# Altium schematic sheet AMU_POC_final.SchDoc
size A; Engineer: Anthony Kellam; : QUTMS Motor Control version 0.1; PageSetup: Record=PageOptions|CenterHorizontal=True|CenterVertical=True|PrintScale=1.00|XCorrection=1.00|YCorrection=1.00|PrintKind=0|BorderSize=5000000|LeftOffset=0|BottomOffset=0|Orientation=1|PaperLength=1000|PaperWidth=1000|Scale=100|PaperSource=7|PrintQuality=-4|MediaType=1|DitherType=10|PaperKind=A4 (210 x 297 mm)|PrintScaleMode=0; DocumentName: QUTMS Motor Control rev A
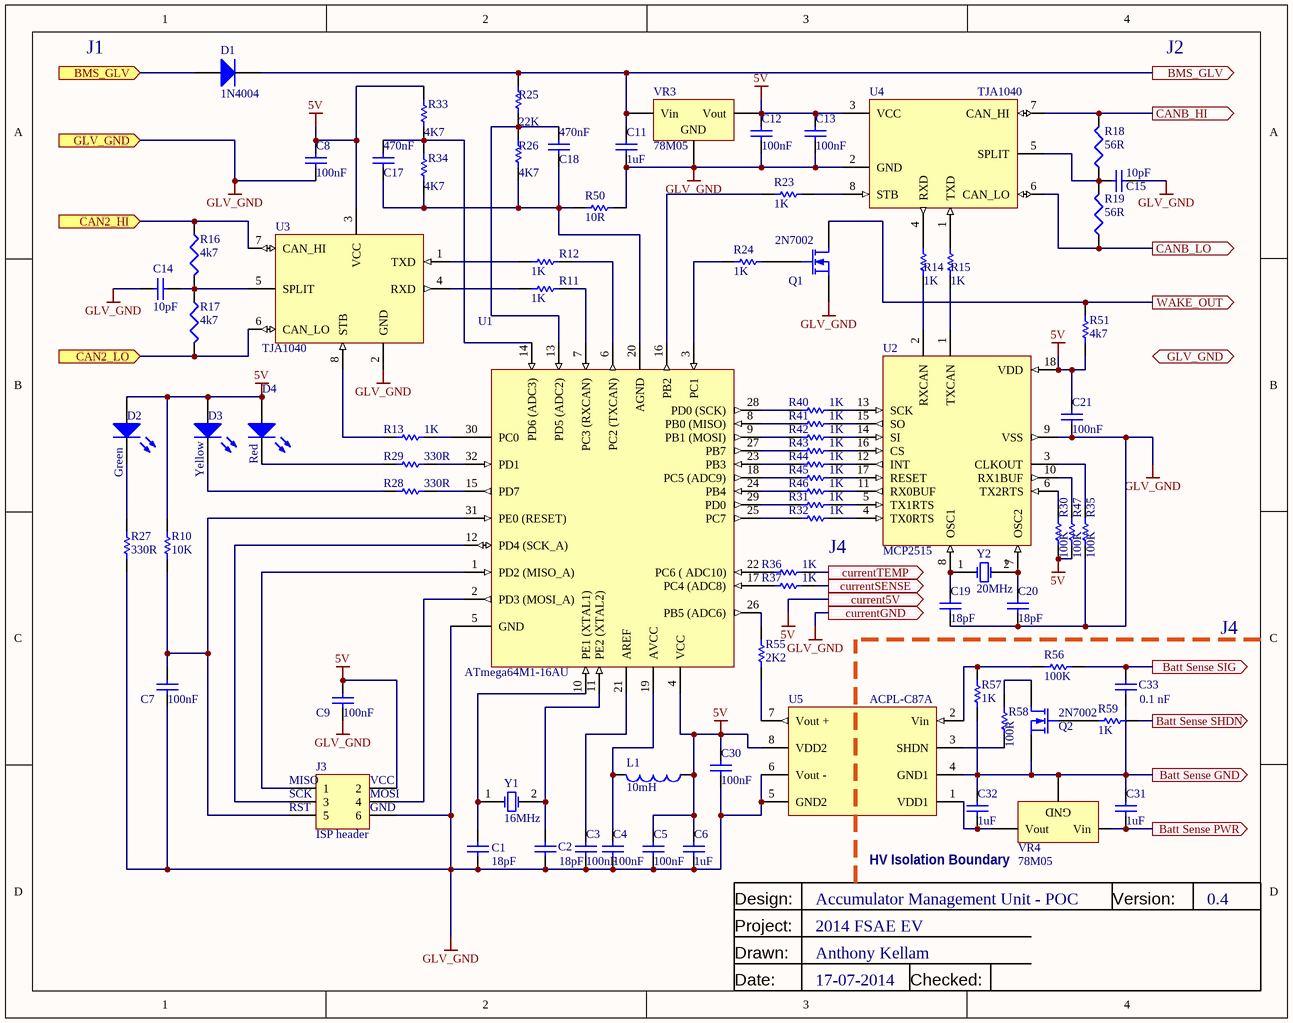
[diagram p0: AMU_POC_final.SchDoc]

## Parts
C1  value 18pF  [0402]  (hidden comment: Cap Semi)
C2  value 18pF  [0402]  (hidden comment: Cap Semi)
C3  value 100nF  [0402]  (hidden comment: Cap Semi)
C4  value 100nF  [0402]  (hidden comment: Cap Semi)
C5  value 100nF  [0402]  (hidden comment: Cap Semi)
C6  value 1uF  [0402]  (hidden comment: Cap Semi)
C7  value 100nF  [0402]  (hidden comment: Cap Semi)
C8  value 100nF  [0402]  (hidden comment: Cap Semi)
C9  value 100nF  [0402]  (hidden comment: Cap Semi)
C11  value 1uF  [0402]  (hidden comment: Cap Semi)
C12  value 100nF  [0402]  (hidden comment: Cap Semi)
C13  value 100nF  [0402]  (hidden comment: Cap Semi)
C14  value 10pF  [0402]  (hidden comment: Cap Semi)
C15  value 10pF  [0402]  (hidden comment: Cap Semi)
C17  value 470nF  [0402]  (hidden comment: Cap Semi)
C18  value 470nF  [0402]  (hidden comment: Cap Semi)
C19  value 18pF  [0402]  (hidden comment: Cap Semi)
C20  value 18pF  [0402]  (hidden comment: Cap Semi)
C21  value 100nF  [0402]  (hidden comment: Cap Semi)
C30  value 100nF  [0402]  (hidden comment: Cap Semi)
C31  value 1uF  [0402]  (hidden comment: Cap Semi)
C32  value 1uF  [0402]  (hidden comment: Cap Semi)
C33  value 0.1 nF  [0402]  (hidden comment: Cap Semi)
D1  1N4004  [SMC]
D2  Green  [3.2X1.6X1.1]
D3  Yellow  [3.2X1.6X1.1]
D4  Red  [3.2X1.6X1.1]
J3  ISP header  [HDR2X3]
L1  value 10mH  [0402-A]  (hidden comment: Inductor)
Q1  2N7002  [E3]
Q2  2N7002  [E3]
R10  value 10K  [AXIAL-0.3]  (hidden comment: Res1)
R11  value 1K  [AXIAL-0.3]  (hidden comment: Res1)
R12  value 1K  [AXIAL-0.3]  (hidden comment: Res1)
R13  value 1K  [AXIAL-0.3]  (hidden comment: Res1)
R14  value 1K  [AXIAL-0.3]  (hidden comment: Res1)
R15  value 1K  [AXIAL-0.3]  (hidden comment: Res1)
R16  value 4k7  [J1-0603]  (hidden comment: Res3)
R17  value 4k7  [J1-0603]  (hidden comment: Res3)
R18  value 56R  [J1-0603]  (hidden comment: Res3)
R19  value 56R  [J1-0603]  (hidden comment: Res3)
R23  value 1K  [AXIAL-0.3]  (hidden comment: Res1)
R24  value 1K  [AXIAL-0.3]  (hidden comment: Res1)
R25  value 22K  [AXIAL-0.3]  (hidden comment: Res1)
R26  value 4K7  [AXIAL-0.3]  (hidden comment: Res1)
R27  value 330R  [AXIAL-0.3]  (hidden comment: Res1)
R28  value 330R  [AXIAL-0.3]  (hidden comment: Res1)
R29  value 330R  [AXIAL-0.3]  (hidden comment: Res1)
R30  value 100K  [AXIAL-0.3]  (hidden comment: Res1)
R31  value 1K  [AXIAL-0.3]  (hidden comment: Res1)
R32  value 1K  [AXIAL-0.3]  (hidden comment: Res1)
R33  value 4K7  [AXIAL-0.3]  (hidden comment: Res1)
R34  value 4K7  [AXIAL-0.3]  (hidden comment: Res1)
R35  value 100K  [AXIAL-0.3]  (hidden comment: Res1)
R36  value 1K  [AXIAL-0.3]  (hidden comment: Res1)
R37  value 1K  [AXIAL-0.3]  (hidden comment: Res1)
R40  value 1K  [AXIAL-0.3]  (hidden comment: Res1)
R41  value 1K  [AXIAL-0.3]  (hidden comment: Res1)
R42  value 1K  [AXIAL-0.3]  (hidden comment: Res1)
R43  value 1K  [AXIAL-0.3]  (hidden comment: Res1)
R44  value 1K  [AXIAL-0.3]  (hidden comment: Res1)
R45  value 1K  [AXIAL-0.3]  (hidden comment: Res1)
R46  value 1K  [AXIAL-0.3]  (hidden comment: Res1)
R47  value 100K  [AXIAL-0.3]  (hidden comment: Res1)
R50  value 10R  [AXIAL-0.3]  (hidden comment: Res1)
R51  value 4k7  [AXIAL-0.3]  (hidden comment: Res1)
R55  value 2K2  [AXIAL-0.3]  (hidden comment: Res1)
R56  value 100K  [AXIAL-0.3]  (hidden comment: Res1)
R57  value 1K  [AXIAL-0.3]  (hidden comment: Res1)
R58  value 100R  [AXIAL-0.3]  (hidden comment: Res1)
R59  value 1K  [AXIAL-0.3]  (hidden comment: Res1)
U1  ATmega64M1-16AU  [32A_L]
U2  MCP2515  [Q-18]
U3  TJA1040  [8S2_L]
U4  TJA1040  [8S2_L]
U5  ACPL-C87A  [8S2_L]
VR3  78M05  [D2PAK]
VR4  78M05  [D2PAK]
Y1  16MHz  [R38]
Y2  20MHz  [R38]

## Ports
Batt Sense GND (out), Batt Sense PWR (out), Batt Sense SHDN (out), Batt Sense SIG (out), BMS_GLV, BMS_GLV (in), CAN2_HI (in), CAN2_LO (in), CANB_HI (out), CANB_LO (out), current5V (out), currentGND (out), currentSENSE (out), currentTEMP (out), GLV_GND (in), GLV_GND (out), WAKE_OUT (out)

## Nets
5V: C5.1 C6.1 C8.2 C9.2 C12.2 C13.2 C21.2 C30.1 D2.1(A) D3.1(A) D4.1(A) J3.2 L1.1 R10.2 R30.2 R33.1 R47.2 R51.1 U1.4(VCC) U2.18(VDD) U3.3(VCC) U4.3(VCC) U5.8(VDD2) VR3.3(Vout) ; port current5V
GLV_GND: C1.1 C2.1 C3.2 C4.2 C5.2 C6.2 C7.1 C8.1 C9.1 C11.1 C12.1 C13.1 C14.1 C15.1 C19.1 C20.1 C21.1 C30.2 J3.6 Q1.3(S) R27.1 R35.2 R50.2 U1.5(GND) U2.9(VSS) U3.2(GND) U4.2(GND) U5.5(GND2) U5.6(Vout_-) VR3.2(GND) ; port GLV_GND, port currentGND
Batt Sense GND: C31.2 C32.2 C33.1 Q2.3(S) R57.1 U5.4(GND1) VR4.2(GND) ; port Batt Sense GND
Batt Sense PWR: C31.1 VR4.1(Vin) ; port Batt Sense PWR
Batt Sense SHDN: R59.1 ; port Batt Sense SHDN
Batt Sense SIG: C33.2 R56.1 ; port Batt Sense SIG
BMS_GLV: C11.2 D1.1(A) D1.2(K) R25.1 VR3.1(Vin) ; port BMS_GLV
CAN2_HI: R16.1 U3.7(CAN_HI) ; port CAN2_HI
CAN2_LO: R17.2 U3.6(CAN_LO) ; port CAN2_LO
CANB_HI: R18.2 U4.7(CAN_HI) ; port CANB_HI
CANB_LO: R19.1 U4.6(CAN_LO) ; port CANB_LO
currentSENSE: R37.2 ; port currentSENSE
currentTEMP: R36.2 ; port currentTEMP
WAKE_OUT: Q1.1(D) R51.2 ; port WAKE_OUT
NetC1_2: C1.2 U1.10(PE1_(XTAL1)) Y1.1(OSC1)
NetC2_2: C2.2 U1.11(PE2_(XTAL2)) Y1.2(OSC2)
NetC3_1: C3.1 U1.21(AREF)
NetC4_1: C4.1 L1.2 U1.19(AVCC)
NetC7_2: C7.2 J3.5 R10.1 U1.31(PE0_(RESET))
NetC14_2: C14.2 R16.2 R17.1 U3.5(SPLIT)
NetC15_2: C15.2 R18.1 R19.2 U4.5(SPLIT)
NetC17_1: C17.1 C18.1 R26.2 R34.2 R50.1 U1.20(AGND)
NetC17_2: C17.2 R33.2 R34.1 U1.14(PD6_(ADC3))
NetC18_2: C18.2 R25.2 R26.1 U1.13(PD5_(ADC2))
NetC19_2: C19.2 U2.8(OSC1) Y2.1(OSC1)
NetC20_2: C20.2 U2.7(OSC2) Y2.2(OSC2)
NetC32_1: C32.1 U5.1(VDD1) VR4.3(Vout)
NetD2_2: D2.2(K) R27.2
NetD3_2: D3.2(K) R28.1
NetD4_2: D4.2(K) R29.1
NetJ3_1: J3.1 U1.1(PD2_(MISO_A))
NetJ3_3: J3.3 U1.12(PD4_(SCK_A))
NetJ3_4: J3.4 U1.2(PD3_(MOSI_A))
NetQ1_2: Q1.2(G) R24.2
NetQ2_1: Q2.1(D) R58.2
NetQ2_2: Q2.2(G) R59.2
NetR11_1: R11.1 U3.4(RXD)
NetR11_2: R11.2 U1.7(PC3_(RXCAN))
NetR12_1: R12.1 U1.6(PC2_(TXCAN))
NetR12_2: R12.2 U3.1(TXD)
NetR13_1: R13.1 U3.8(STB)
NetR13_2: R13.2 U1.30(PC0)
NetR14_1: R14.1 U4.4(RXD)
NetR14_2: R14.2 U2.2(RXCAN)
NetR15_1: R15.1 U4.1(TXD)
NetR15_2: R15.2 U2.1(TXCAN)
NetR23_1: R23.1 U1.16(PB2)
NetR23_2: R23.2 U4.8(STB)
NetR24_1: R24.1 U1.3(PC1)
NetR28_2: R28.2 U1.15(PD7)
NetR29_2: R29.2 U1.32(PD1)
NetR30_1: R30.1 U2.6(TX2RTS)
NetR31_1: R31.1 U1.29(PD0)
NetR31_2: R31.2 U2.5(TX1RTS)
NetR32_1: R32.1 U1.25(PC7)
NetR32_2: R32.2 U2.4(TX0RTS)
NetR35_1: R35.1 U2.3(CLKOUT)
NetR36_1: R36.1 U1.22(PC6_(_ADC10))
NetR37_1: R37.1 U1.17(PC4_(ADC8))
NetR40_1: R40.1 U1.28(PD0_(SCK))
NetR40_2: R40.2 U2.13(SCK)
NetR41_1: R41.1 U1.8(PB0_(MISO))
NetR41_2: R41.2 U2.15(SO)
NetR42_1: R42.1 U1.9(PB1_(MOSI))
NetR42_2: R42.2 U2.14(SI)
NetR43_1: R43.1 U1.27(PB7)
NetR43_2: R43.2 U2.16(CS)
NetR44_1: R44.1 U1.23(PB3)
NetR44_2: R44.2 U2.12(INT)
NetR45_1: R45.1 U1.18(PC5_(ADC9))
NetR45_2: R45.2 U2.17(RESET)
NetR46_1: R46.1 U1.24(PB4)
NetR46_2: R46.2 U2.11(RX0BUF)
NetR47_1: R47.1 U2.10(RX1BUF)
NetR55_1: R55.1 U5.7(Vout_+)
NetR55_2: R55.2 U1.26(PB5_(ADC6))
NetR56_2: R56.2 R57.2 U5.2(Vin)
NetR58_1: R58.1 U5.3(SHDN)

## Notes on the sheet
- J1
- J2
- J4
- (near J3) SCK
- (near J3) RST
- (near J3) MISO
- (near J3) MOSI
- (near J3) GND
- (near J3) VCC
- (near C6) Design:
- Accumulator Management Unit - POC
- HV Isolation Boundary
- Version:
- 0.4
- Project:
- Drawn:
- 2014 FSAE EV
- Anthony Kellam
- Date:
- 17-07-2014
- Checked:

## Library data of the parts
C1-C9 C11-C15 C17-C21 C30-C33 = Cap Semi: Capacitor (Semiconductor SIM Model); Published: 8-Jun-2000; LatestRevisionDate: 17-Jul-2002; LatestRevisionNote: Re-released for DXP Platform.; PackageReference: C1206; Publisher: Altium Limited
D1 = Diode: Default Diode; Published: 8-Jun-2000; LatestRevisionDate: 17-Jul-2002; LatestRevisionNote: Re-released for DXP Platform.; PackageDocument: Sep-1996; PackageReference: SMC; Publisher: Altium Limited; Code_JEDEC: DO-214-AB
D2-D4 = LED2: Typical RED, GREEN, YELLOW, AMBER GaAs LED; Published: 8-Jun-2000; LatestRevisionDate: 17-Jul-2002; LatestRevisionNote: Re-released for DXP Platform.; PackageDocument: Feb-2002; PackageReference: 3.2X1.6X1.1; Publisher: Altium Limited
J3 = Header 3X2: Header, 3-Pin, Dual row; LatestRevisionDate: 17-Jul-2002; LatestRevisionNote: Re-released for DXP Platform.; Publisher: Altium Limited
L1 = Inductor: Code_IEC: 1005; Published: 8-Jun-2000; LatestRevisionDate: 17-Jul-2002; LatestRevisionNote: Re-released for DXP Platform.; PackageReference: 0402-A; Publisher: Altium Limited; Code_JEITA: 0402
Q1 Q2 = MOSFET-N: N-Channel MOSFET; PackageDocument: 1995/1996; Published: 8-Jun-2000; LatestRevisionDate: 17-Jul-2002; LatestRevisionNote: Re-released for DXP Platform.; PackageReference: E3; Publisher: Altium Limited
R10-R15 R23-R37 R40-R47 R50 R51 R55-R59 = Res1: Resistor; Published: 8-Jun-2000; LatestRevisionDate: 17-Jul-2002; LatestRevisionNote: Re-released for DXP Platform.; PackageReference: AXIAL-0.3; Publisher: Altium Limited
R16-R19 = Res3: Resistor; Published: 8-Jun-2000; LatestRevisionDate: 04-Mar-2005; LatestRevisionNote: PCB Footprint replaced.; PackageReference: J1-0603; Publisher: Altium Limited
U1 = ATmega8-16AC: 8-Bit AVR Microcontroller with 8K Bytes of In-System Programmable Flash Memory; Published: 17-Sep-2003; LatestRevisionDate: 13-Apr-2006; LatestRevisionNote: IPC-7351 Footprint Added.; DatasheetVersion: 2486H-AVR-09/02; PackageVersion: revB, Oct-2001; PackageReference: 32A; Publisher: Altium Limited; PackageDescription: 32-Pin Thin Quad Flat Pack 0.8 mm Pitch; Code_JEDEC: MS-026-ABA; ComponentLink1Description: Manufacturer Link; ComponentLink1URL: http://www.atmel.com; ComponentLink2Description: Datasheet; ComponentLink2URL: http://www.atmel.com/dyn/resources/prod_documents/doc2486.pdf
U2 = AMP01AX/883: Low-Noise, Precision Instrumentation Amplifier; Note: Pin 6 is a test pin.  Make no electrical connection to pin 6; Published: 8-Jun-2000; LatestRevisionDate: 04-Mar-2005; LatestRevisionNote: Stylized 3D Model Added.; DatasheetVersion: REV.C1 1990; PackageReference: Q-18; Publisher: Altium Limited; PackageDescription: DIP, Ceramic; 18 Leads; Row Spacing 7.62 mm; Pitch 2.54 mm; ComponentLink1Description: Manufacturer Link; ComponentLink1URL: http://www.analog.com/en/prod/0%2C2877%2CAMP01%2C00.html; ComponentLink2Description: Datasheet; ComponentLink2URL: http://www.analog.com/UploadedFiles/Data_Sheets/376080747AMP01_d.pdf
U3-U5 = AT90S2343-10SI: Isolated CAN transceiver; Published: 17-Sep-2003; LatestRevisionDate: 13-Apr-2006; LatestRevisionNote: IPC-7351 Footprint Added.; DatasheetVersion: 1004D-09/01; PackageVersion: revB, May-2002; PackageReference: 8S2; Publisher: Altium Limited; PackageDescription: 8-Pin Small Outline Package 1.27 mm Pitch; ComponentLink1Description: Manufacturer Link; ComponentLink1URL: http://www.atmel.com; ComponentLink2Description: Datasheet; ComponentLink2URL: http://www.atmel.com/dyn/resources/prod_documents/doc1004.pdf
VR3 VR4 = Volt Reg: Published: 24-Mar-1999; LatestRevisionDate: 17-Jul-2002; LatestRevisionNote: Re-released for DXP Platform.; PackageReference: D2PAK; Publisher: Altium Limited; Code_JEDEC: SMD-220
Y1 Y2 = XTAL: Crystal Oscillator; Published: 8-Jun-2000; LatestRevisionDate: 17-Jul-2002; LatestRevisionNote: Re-released for DXP Platform.; PackageReference: R38; Publisher: Altium Limited